# EAGLE design scHnRk_3 (EAGLE 7.5.0)
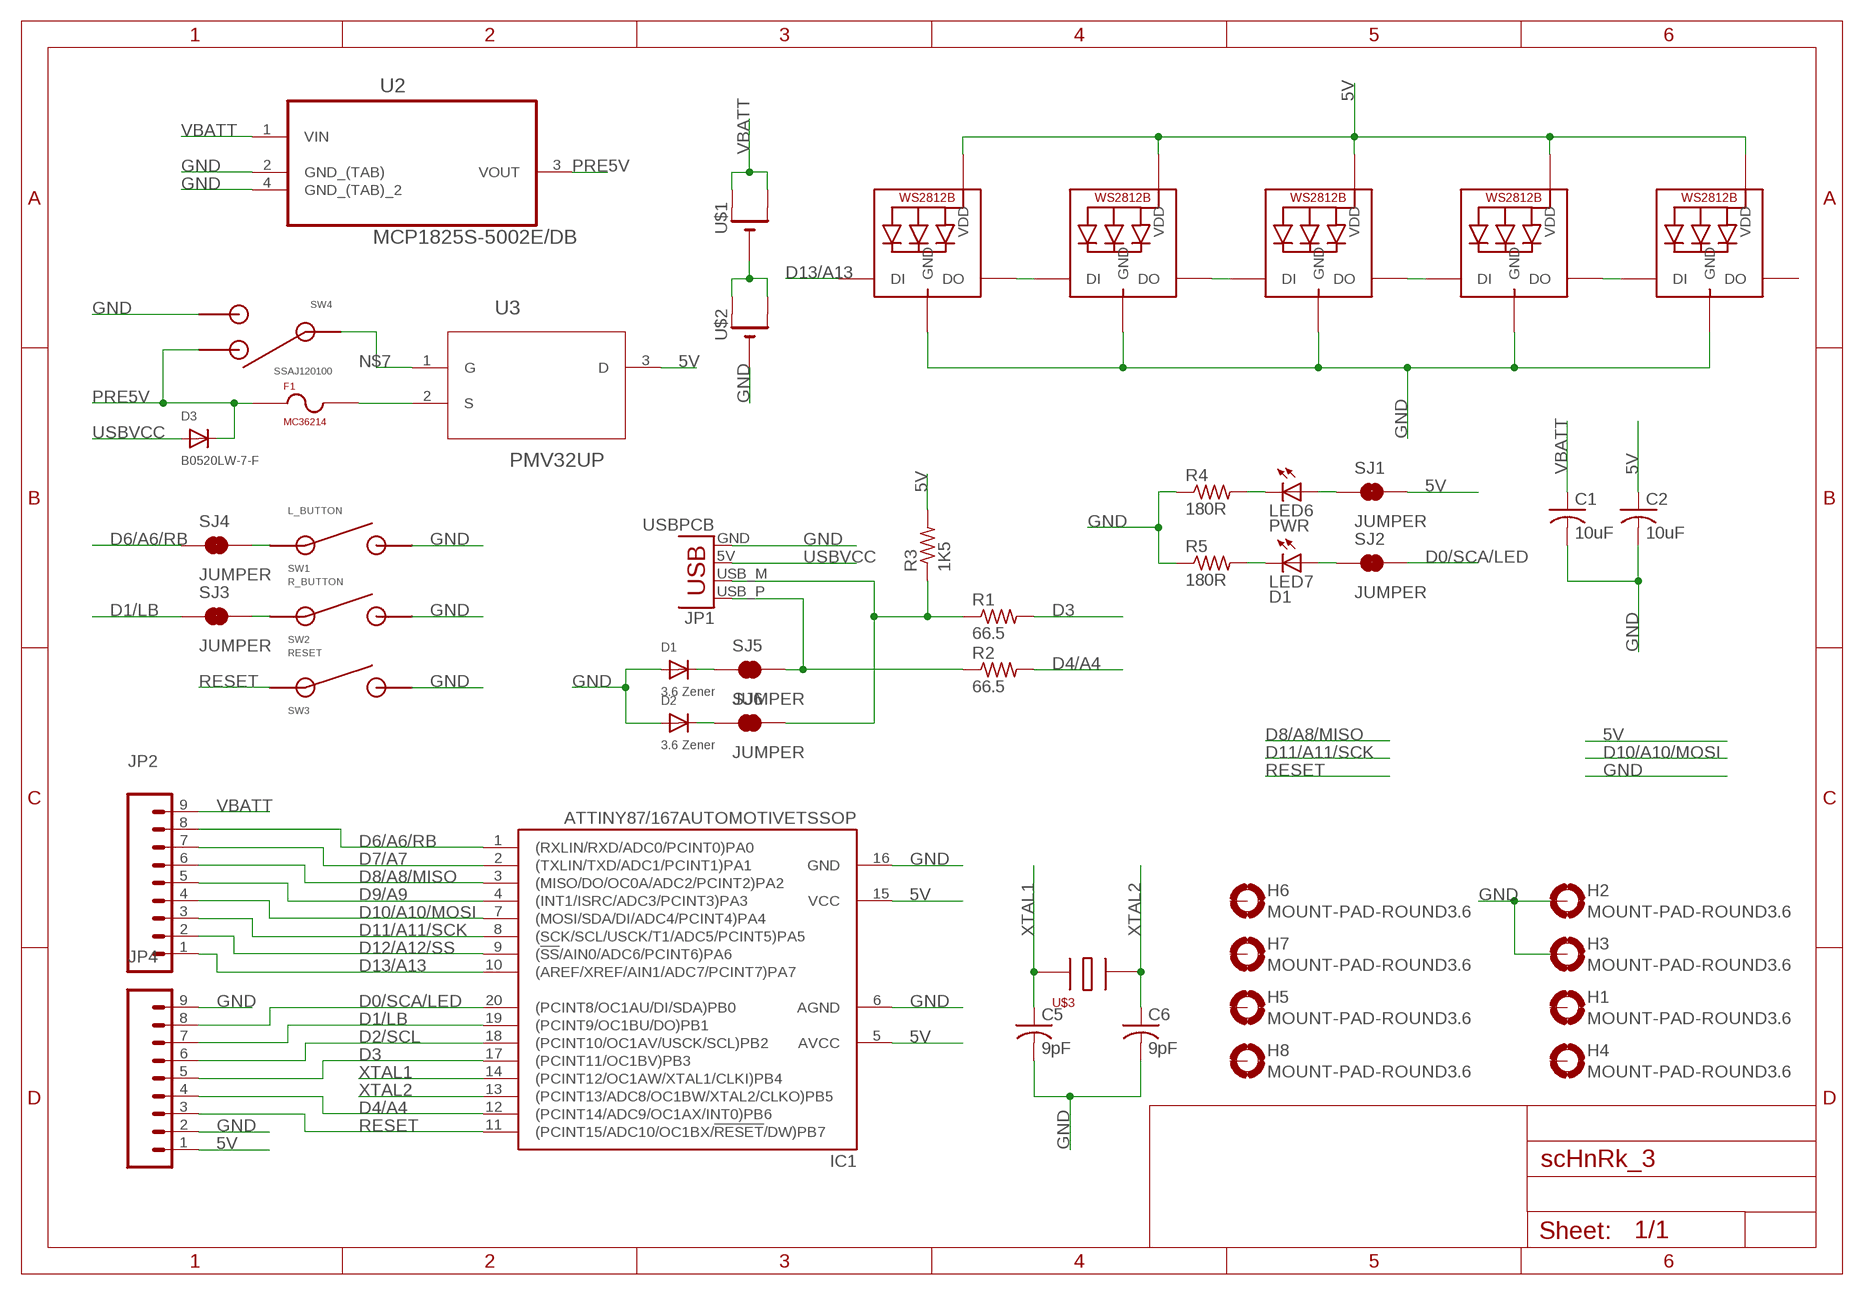
[diagram p0: schematic, sheet 1]

## Parts
C1  10uF  C-USC1206K  [C1206K]
C2  10uF  C-USC1206K  [C1206K]
C5  9pF  C-USC0603K  [C0603K]
C6  9pF  C-USC0603K  [C0603K]
D1  3.6 Zener  DIODESOD-523  [SOD-523]
D2  3.6 Zener  DIODESOD-523  [SOD-523]
D3  B0520LW-7-F  DIODESOD-123  [SOD-123]
F1  MC36214  [MC36214]
H1  MOUNT-PAD-ROUND3.6  [3,6-PAD]
H2  MOUNT-PAD-ROUND3.6  [3,6-PAD]
H3  MOUNT-PAD-ROUND3.6  [3,6-PAD]
H4  MOUNT-PAD-ROUND3.6  [3,6-PAD]
H5  MOUNT-PAD-ROUND3.6  [3,6-PAD]
H6  MOUNT-PAD-ROUND3.6  [3,6-PAD]
H7  MOUNT-PAD-ROUND3.6  [3,6-PAD]
H8  MOUNT-PAD-ROUND3.6  [3,6-PAD]
IC1  ATTINY87/167AUTOMOTIVETSSOP  [TSSOP20]
JP1  USBPCB  [USB-A-PCB]
JP2  M09  [1X09]
JP4  M09  [1X09]
LED1  WS2812B5050  [WS2812B]
LED2  WS2812B5050  [WS2812B]
LED3  WS2812B5050  [WS2812B]
LED4  WS2812B5050  [WS2812B]
LED5  WS2812B5050  [WS2812B]
LED6  PWR  LEDCHIPLED_0603  [CHIPLED_0603]
LED7  D1  LEDCHIPLED_0603  [CHIPLED_0603]
R1  66.5  R-US_R0603  [R0603]
R2  66.5  R-US_R0603  [R0603]
R3  1K5  R-US_R0603  [R0603]
R4  180R  R-US_R0603  [R0603]
R5  180R  R-US_R0603  [R0603]
SJ1  JUMPER  JUMPER-PAD-2-NC_BY_TRACE  [PAD-JUMPER-2-NC_BY_TRACE_YES_SILK]
SJ2  JUMPER  JUMPER-PAD-2-NC_BY_TRACE  [PAD-JUMPER-2-NC_BY_TRACE_YES_SILK]
SJ3  JUMPER  JUMPER-PAD-2-NC_BY_TRACE  [PAD-JUMPER-2-NC_BY_TRACE_YES_SILK]
SJ4  JUMPER  JUMPER-PAD-2-NC_BY_TRACE  [PAD-JUMPER-2-NC_BY_TRACE_YES_SILK]
SJ5  JUMPER  JUMPER-PAD-2-NC_BY_TRACE  [PAD-JUMPER-2-NC_BY_TRACE_YES_SILK]
SJ6  JUMPER  JUMPER-PAD-2-NC_BY_TRACE  [PAD-JUMPER-2-NC_BY_TRACE_YES_SILK]
SW1  L_BUTTON  SKRBAGE010  [SKRBAGE010]
SW2  R_BUTTON  SKRBAGE010  [SKRBAGE010]
SW3  RESET  SKRBAGE010  [SKRBAGE010]
SW4  SSAJ120100  [SSAJ120100]
U2  MCP1825S-5002E/DB  [SOT230P700X180-4N]
U3  PMV32UP  [SOT95P230X110-3N]
U$1  CR2032SMT  [CR2032-SMD]
U$2  CR2032SMT  [CR2032-SMD]
U$3  16MHZ-2467444  [16MHZ-2467444]

## Nets
5V: C2.1 IC1.5(AVCC) IC1.15(VCC) JP4.1 LED1.1-VDD(VDD) LED2.1-VDD(VDD) LED3.1-VDD(VDD) LED4.1-VDD(VDD) LED5.1-VDD(VDD) R3.2 SJ1.2 U3.3(D)
D0/SCA/LED: IC1.20((PCINT8/OC1AU/DI/SDA)PB0) JP4.8 SJ2.2
D1/LB: IC1.19((PCINT9/OC1BU/DO)PB1) JP4.7 SJ3.1
D2/SCL: IC1.18((PCINT10/OC1AV/USCK/SCL)PB2) JP4.6
D3: IC1.17((PCINT11/OC1BV)PB3) JP4.5 R1.2
D4/A4: IC1.12((PCINT14/ADC9/OC1AX/INT0)PB6) JP4.4 R2.2
D6/A6/RB: IC1.1((RXLIN/RXD/ADC0/PCINT0)PA0) JP2.8 SJ4.1
D7/A7: IC1.2((TXLIN/TXD/ADC1/PCINT1)PA1) JP2.7
D8/A8/MISO: IC1.3((MISO/DO/OC0A/ADC2/PCINT2)PA2) JP2.6
D9/A9: IC1.4((INT1/ISRC/ADC3/PCINT3)PA3) JP2.5
D10/A10/MOSI: IC1.7((MOSI/SDA/DI/ADC4/PCINT4)PA4) JP2.4
D11/A11/SCK: IC1.8((SCK/SCL/USCK/T1/ADC5/PCINT5)PA5) JP2.3
D12/A12/SS: IC1.9((!SS!/AIN0/ADC6/PCINT6)PA6) JP2.2
D13/A13: IC1.10((AREF/XREF/AIN1/ADC7/PCINT7)PA7) JP2.1 LED1.4-DIN(DI)
GND: C1.2 C2.2 C5.2 C6.2 D1.A D2.A H2.B3,6(MOUNT) H3.B3,6(MOUNT) IC1.6(AGND) IC1.16(GND) JP1.GND JP4.2 JP4.9 LED1.3-GND(GND) LED2.3-GND(GND) LED3.3-GND(GND) LED4.3-GND(GND) LED5.3-GND(GND) R4.1 R5.1 SW1.P$2 SW1.P$4 SW2.P$2 SW2.P$4 SW3.P$2 SW3.P$4 SW4.P$2 U2.2(GND_(TAB)) U2.4(GND_(TAB)_2) U$2.-
N$1: U$1.- U$2.+$1(+) U$2.+$2(+1)
N$2: SJ4.2 SW1.P$1 SW1.P$3
N$3: LED1.2-DOUT(DO) LED2.4-DIN(DI)
N$4: LED2.2-DOUT(DO) LED3.4-DIN(DI)
N$5: LED3.2-DOUT(DO) LED4.4-DIN(DI)
N$6: LED4.2-DOUT(DO) LED5.4-DIN(DI)
N$7: SW4.P$C U3.1(G)
N$8: SJ3.2 SW2.P$1 SW2.P$3
N$9: D1.K(C) SJ5.1
N$10: D2.K(C) SJ6.1
N$15: JP1.USB_M(D-) R1.1 R3.1 SJ6.2
N$16: JP1.USB_P(D+) R2.1 SJ5.2
N$22: F1.P$2 U3.2(S)
N$28: LED6.C R4.2
N$29: LED7.C R5.2
N$31: LED6.A SJ1.1
N$34: LED7.A SJ2.1
PRE5V: D3.C F1.P$1 SW4.P$1 U2.3(VOUT)
RESET: IC1.11((PCINT15/ADC10/OC1BX/!RESET!/DW)PB7) JP4.3 SW3.P$1 SW3.P$3
USBVCC: D3.A JP1.5V(VBUS)
VBATT: C1.1 JP2.9 U2.1(VIN) U$1.+$1(+) U$1.+$2(+1)
XTAL1: C5.1 IC1.14((PCINT12/OC1AW/XTAL1/CLKI)PB4) U$3.P$1
XTAL2: C6.1 IC1.13((PCINT13/ADC8/OC1BW/XTAL2/CLKO)PB5) U$3.P$3
Unconnected: H1.B3,6(MOUNT) H4.B3,6(MOUNT) H5.B3,6(MOUNT) H6.B3,6(MOUNT) H7.B3,6(MOUNT) H8.B3,6(MOUNT) LED5.2-DOUT(DO)

## Library data of the parts
C1 C2 C5 C6 = adafruit:C-US: CAPACITOR, American symbol
D1-D3 = adafruit:DIODE: Diode SMADIODE - SMA Surface Mount Package 20V 1A Schottky Diode Digikey: 641-1014-6-ND DO-1N4148 - Through Hole Small Current Diode SOD-123 20V 1 A (.5mV Vf) Schottky Diode - Digikey: MBRX120TPMSCT-ND SOD-323 10V 570mA (.38mV Vf, 3ns) Schottky Diode - Digikey: ZLLS410CT-ND SOD-523 30V 30mA Schottky Diode (RB751S-40TE61) - Digikey: RB751S-40TE61CT-ND SOT23-R/W - SOT23 Package (R = Solder Paste/Reflow Ovens, W = Hand-Soldering) BAT54Film 40V 300mA - Digikey: 497-7162-1-ND
F1 = scHnRk:MC36214
H1-H8 = holes:MOUNT-PAD-ROUND: MOUNTING PAD, round
IC1 = attiny87_167_automotive:ATTINY87/167AUTOMOTIVE
JP1 = SparkFun-Connectors:USB: USB Connectors USB-B-PTH is fully proven SKU : PRT-00139/CONN-08278 USB-miniB is fully proven SKU : PRT-00587 USB-A-PCB is untested. USB-A-H is throughly reviewed, but untested. Spark Fun Electronics SKU : PRT-00437 USB-B-SMT is throughly reviewed, but untested. Needs silkscreen touching up. USB-A-S has not been used/tested USB-MB-H has not been used/tested USB-MICROB has been used. CONN-09505
JP2 JP4 = SparkFun-Connectors:M09: Header 9 Standard 9-pin 0.1" header. Use with straight break away headers (SKU : PRT-00116), right angle break away headers (PRT-00553), swiss pins (PRT-00743), machine pins (PRT-00117), and female headers (PRT-00115).
LED1-LED5 = adafruit:WS2812B
LED6 LED7 = adafruit:LED: LED OSRAM: - CHIPLED LG R971, LG N971, LY N971, LG Q971, LY Q971, LO R971, LY R971 LH N974, LH R974 LS Q976, LO Q976, LY Q976 LO Q996 - Hyper CHIPLED LW Q18S LB Q993, LB Q99A, LB R99A - SideLED LS A670, LO A670, LY A670, LG A670, LP A670 LB A673, LV A673, LT A673, LW A673 LH A674 LY A675 LS A676, LA A676, LO A676, LY A676, LW A676 LS A679, LY A679, LG A679 - Hyper Micro SIDELED® LS Y876, LA Y876, LO Y876, LY Y876 LT Y87S - SmartLED LW L88C, LW L88S LB L89C, LB L89S, LG L890 LS L89K, LO L89K, LY L89K LS L896, LA L896, LO L896, LY L896 - TOPLED LS T670, LO T670, LY T670, LG T670, LP T670 LSG T670, LSP T670, LSY T670, LOP T670, LYG T670 LG T671, LOG T671, LSG T671 LB T673, LV T673, LT T673, LW T673 LH T674 LS T676, LA T676, LO T676, LY T676, LB T676, LH T676, LSB T676, LW T676 LB T67C, LV T67C, LT T67C, LS T67K, LO T67K, LY T67K, LW E67C LS E67B, LA E67B, LO E67B, LY E67B, LB E67C, LV E67C, LT E67C LW T67C LS T679, LY T679, LG T679 LS T770, LO T770, LY T770, LG T770, LP T770 LB T773, LV T773, LT T773, LW T773 LH T774 LS E675, LA E675, LY E675, LS T675 LS T776, LA T776, LO T776, LY T776, LB T776 LHGB T686 LT T68C, LB T68C - Hyper Mini TOPLED® LB M676 - Mini TOPLED Santana® LG M470 LS M47K, LO M47K, LY M47K Source: http://www.osram.convergy.de/
R1-R5 = adafruit:R-US_: RESISTOR, American symbol
SJ1-SJ6 = SparkFun-Passives:JUMPER-PAD-2-NC_BY_TRACE
SW1-SW3 = scHnRk:SKRBAGE010
SW4 = scHnRk:SSAJ120100
U2 = Microchip_By_element14_Batch_1:MCP1825S-5002E/DB: IC, LDO, 5.0V, 500MA; MPN: MCP1825S-5002E/DB; OC_FARNELL: 1578407; OC_NEWARK: 26M9964; PACKAGE: SOT-223-3; SUPPLIER: Microchip
U3 = NXP_By_element14_Batch_1:PMV32UP: P-channel Trench MOSFET; MPN: PMV32UP; OC_FARNELL: 1894624; OC_NEWARK: 47T2356; PACKAGE: SOT-3; SUPPLIER: NXP Semiconductors
U$1 U$2 = adafruit:CR2032
U$3 = scHnRk:16MHZ-2467444

## Net classes
0 default: clearance 0.508 mm

## Board
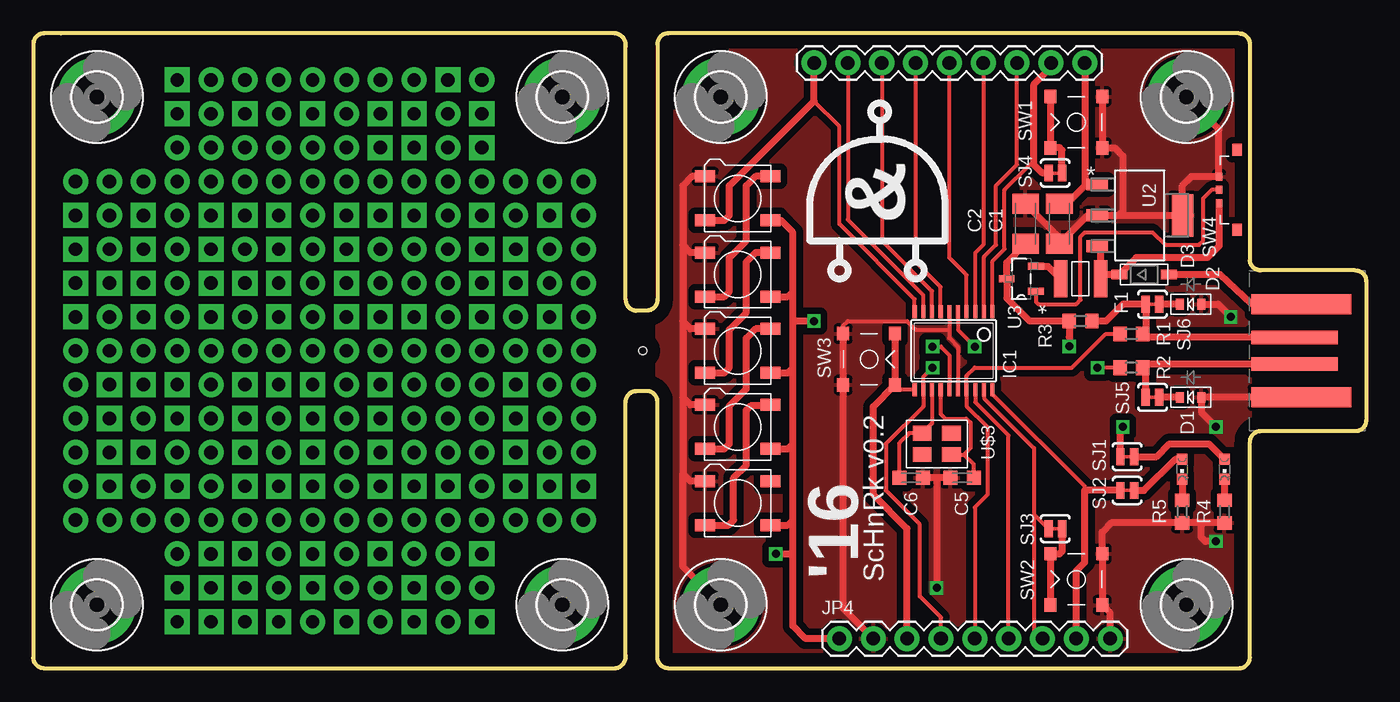
[diagram p1: board, top side]
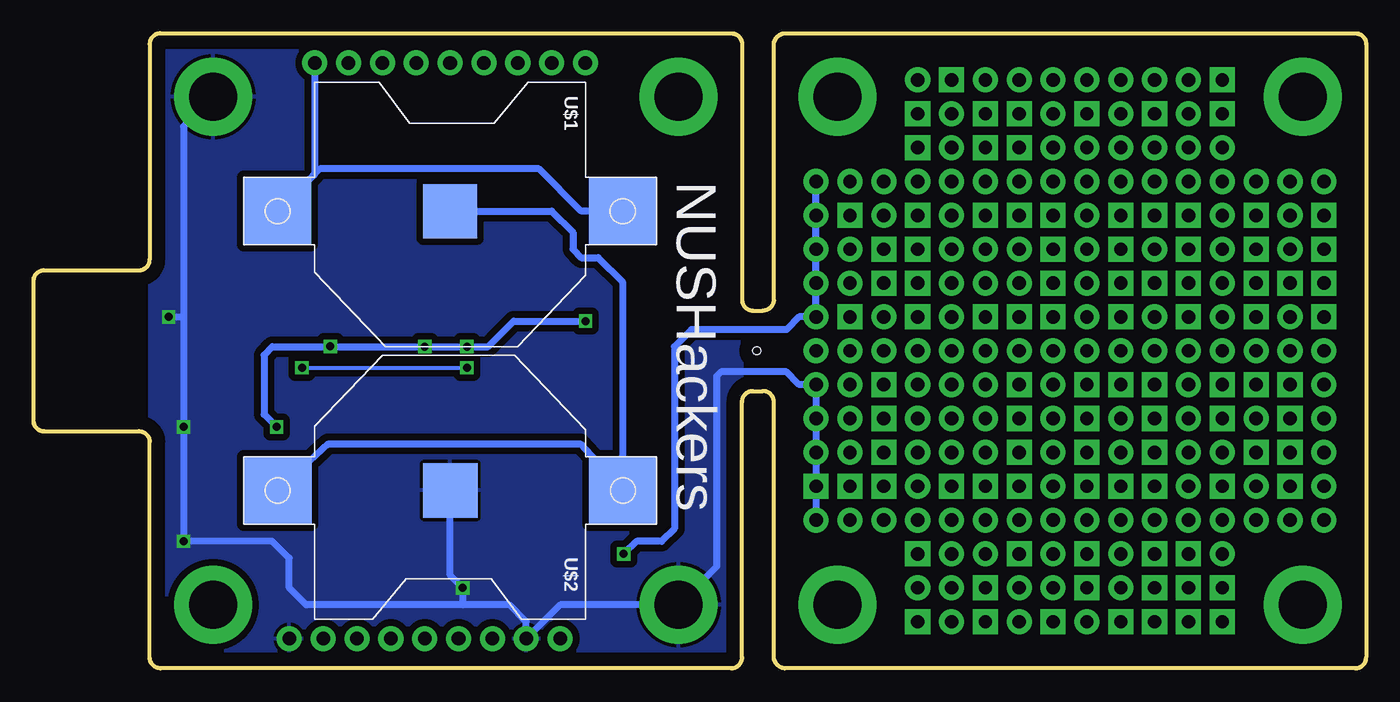
[diagram p2: board, bottom side, seen from below]

Size 100.01 x 47.62 mm. Coordinates in mm from the lower left corner, seen from the top.
Outline: 2.08,47.63 43.64,47.63 arc-90 44.45,46.65 44.45,27.64 arc90 45.26,26.83 46.02,26.83 arc90 46.83,27.64 46.83,46.81 arc-90 47.64,47.63 90.47,47.63 arc-90 91.28,46.81 91.28,30.66 arc90 92.09,29.84 99.2,29.84 arc-90 100.01,29.03 100.01,18.59 arc-90 99.2,17.78 92.09,17.78 arc90 91.28,16.97 91.28,0.81 arc-90 90.47,0 47.64,0 arc-90 46.83,0.81 46.83,19.98 arc90 46.02,20.8 45.26,20.8
Outline: 45.26,20.8 45.24,20.8
Outline: 45.26,20.8 arc90 44.45,19.98 44.45,0.97 arc-90 43.64,0 0.81,0 arc-90 0,0.81 0,46.81 arc-90 0.81,47.63 2.06,47.63
Copper layers (1*16): Top 0.035mm / dielectric 1.5mm / Bottom 0.035mm
Design rules "default *": minimum track width 10mil, minimum drill 24mil, track to track 10mil, track to pad 10mil, pad to pad 10mil, via to via 10mil, smd to smd 10mil, copper to edge 40mil, drill to drill 12mil, minimum pad ring 10mil, minimum via ring 8mil, stop-mask expansion 4mil, vias tented up to drill 0mil, thermal gap 10mil
Holes 0.6 mm at 45.72,23.81

### Footprints (pad centres in the part's own frame; a part is rotated, then mirrored left to right if it is on the bottom)
C1206K = smd 1.5 x 2: 1 -1.5,0; 2 1.5,0
C0603K = smd 1.05 x 1.08: 1 -0.875,0; 2 0.875,0
SOD-523 = smd 0.8 x 0.6: A 0,-0.8; K 0,0.8
SOD-123 = smd 1.2 x 0.7: A 1.85,0; C -1.85,0
MC36214 = smd 1 x 2.8: P$1 -1.5,0; P$2 1.5,0
3,6-PAD = drill 3.6 pad 5.842: B3,6 0,0
TSSOP20 = smd 0.305 x 0.991: 1 -2.925,-2.918; 2 -2.275,-2.918; 3 -1.625,-2.918; 4 -0.975,-2.918; 5 -0.325,-2.918; 6 0.325,-2.918; 7 0.975,-2.918; 8 1.625,-2.918; 9 2.275,-2.918; 10 2.925,-2.918; 11 2.925,2.918; 12 2.275,2.918; 13 1.625,2.918; 14 0.975,2.918; 15 0.325,2.918; 16 -0.325,2.918; 17 -0.975,2.918; 18 -1.625,2.918; 19 -2.275,2.918; 20 -2.925,2.918
USB-A-PCB = smd 7.5 x 1.5: 5V -0.2,-3.5; GND -0.2,3.5 | smd 6.5 x 1: USB_M 0.3,-1; USB_P 0.3,1
1X09 = drill 1.016 pad 1.88: 1 0,0; 2 2.54,0; 3 5.08,0; 4 7.62,0; 5 10.16,0; 6 12.7,0; 7 15.24,0; 8 17.78,0; 9 20.32,0
WS2812B = smd 1.5 x 0.9: 1-VDD 2.45,-1.65; 2-DOUT 2.45,1.65; 3-GND -2.45,1.65; 4-DIN -2.45,-1.65
CHIPLED_0603 = smd 0.8 x 0.8: A 0,-0.75; C 0,0.75
R0603 = smd 1 x 1.1: 1 -0.85,0; 2 0.85,0
PAD-JUMPER-2-NC_BY_TRACE_YES_SILK = smd 0.635 x 1.27: 1 -0.508,0; 2 0.508,0
SKRBAGE010 = smd 1 x 0.9: P$1 -1.925,1.95; P$2 -1.925,-1.95; P$3 1.925,1.95; P$4 1.925,-1.95
SSAJ120100 = smd 0.6 x 0.51: P$1 -1,1.36; P$2 1,1.36; P$C 0,1.36 | smd 0.9 x 0.7: P$3 -3,0; P$4 3,0
SOT230P700X180-4N = smd 1.626 x 0.889: 1 -3.2,2.311; 2 -3.2,0; 3 -3.2,-2.311 | smd 1.626 x 3.175: 4 3.2,0
SOT95P230X110-3N = smd 1.168 x 0.533: 1 -1.092,0.94; 2 -1.092,-0.94; 3 1.092,0
CR2032-SMD = smd 5.08 x 5.08: +$1 -12.954,0; +$2 12.954,0 | smd 4.064 x 4.064: - 0,0
16MHZ-2467444 = smd 1.4 x 1.1: P$1 -1.1,0.8; P$2 1.1,0.8; P$3 1.1,-0.8; P$4 -1.1,-0.8

### Placement (x,y rotation side)
C1  76.99,33.34 270 top
C2  74.45,33.34 90 top
C5  69.69,14.29 180 top
C6  65.88,14.29 0 top
D1  86.84,20.32 90 top
D2  86.84,27.3 90 top
D3  83.34,29.53 0 top
F1  78.58,29.21 180 top
H1  51.59,42.86 0 top
H2  51.59,4.76 0 top
H3  86.52,42.86 0 top
H4  86.52,4.76 0 top
H5  39.69,42.86 0 top
H6  39.69,4.76 0 top
H7  4.76,4.76 0 top
H8  4.76,42.86 0 top
IC1  69.06,23.81 180 top
JP1  94.93,23.81 180 top
JP2  58.58,45.4 0 top
JP4  60.48,2.22 0 top
LED1  52.86,35.24 0 top
LED2  52.86,29.53 0 top
LED3  52.86,23.81 0 top
LED4  52.86,18.1 0 top
LED5  52.86,12.38 0 top
LED6  89.38,14.92 180 top
LED7  86.2,14.92 180 top
R1  82.39,25.08 180 top
R2  82.39,22.54 180 top
R3  78.58,26.04 180 top
R4  89.38,11.75 90 top
R5  86.2,11.75 90 top
SJ1  82.07,15.88 180 top
SJ2  82.07,13.33 180 top
SJ3  76.68,10.48 0 top
SJ4  76.68,37.15 0 top
SJ5  83.98,20.32 180 top
SJ6  83.98,27.3 180 top
SW1  78.26,40.96 90 top
SW2  78.26,6.67 90 top
SW3  62.71,23.18 270 top
SW4  90.33,35.88 90 top
U2  83.03,33.97 0 top
U3  74.14,29.21 180 top
U$1  68.74,34.29 0 bottom
U$2  68.73,13.33 180 bottom
U$3  67.79,16.83 180 top

### Tracks (layer width: path | path; a pad name or v marks a point on that pad's centre or on a via)
5V  (via drill 0.6, 1 pad 1.88)
  Top 0.305: IC1.5 69.38,25.39 v70.64,24.13 | v67.47,24.13 68.1,24.13 68.74,23.5 IC1.15
  Top 0.508: LED5.1-VDD 56.61,10.73 56.99,11.11 | LED1.1-VDD 56.1,33.59 56.99,32.7 56.99,28.26 | 56.99,11.11 56.99,16.83 | 56.99,16.83 56.99,22.54 | 56.99,22.54 56.99,25.88 | 56.99,25.88 56.99,28.26 | LED4.1-VDD 56.61,16.45 56.99,16.83 | LED3.1-VDD 56.61,22.16 56.99,22.54 | LED2.1-VDD 56.61,27.88 56.99,28.26 | JP4.1 57.94,2.22 56.99,3.18 56.99,8.57 | 56.99,8.57 56.99,11.11 | C2.1 73.04,30.43 U3.3 73.04,27.76 74.77,26.04 R3.2 77.73,24.83 v77.73,24.14 | SJ1.2 81.57,17.91 v81.76,18.1 | v58.58,26.04 57.15,26.04 56.99,25.88 | v55.72,8.57 56.99,8.57
  Bottom 0.508: 77.81,24.13 82.07,24.13 82.71,23.5 82.71,19.05 v81.76,18.1 | 77.81,24.13 v70.64,24.13 v67.47,24.13 65.88,24.13 63.98,26.04 v58.58,26.04 | v77.73,24.14 77.73,24.21 77.81,24.13 | v55.72,8.57 54.77,9.52 52.86,9.52 51.91,10.48 51.91,24.13 50.64,25.4 43.5,25.4 42.55,26.35 v41.28,26.35 v41.28,28.89 v41.28,31.43 v41.28,33.97 v41.28,36.51
D0/SCA/LED
  Top 0.305: 78.9,13.33 78.9,13.65 71.98,20.57 IC1.20
  Top 0.508: JP4.8 78.26,7.3 78.9,7.94 78.9,13.33 SJ2.2
D1/LB
  Top 0.305: IC1.19 71.33,20.27 75.09,16.51 75.09,11.56 | 75.09,11.56 75.09,2.86 JP4.7 | 75.09,11.56 SJ3.1
D2/SCL
  Top 0.305: IC1.18 70.68,19.97 73.18,17.46 JP4.6
D3
  Top 0.305: JP4.5 70.64,12.07 71.6,13.02 71.6,18.1 70.03,19.66 IC1.17 70.03,21.93 70.64,22.54 77.95,22.54 80.49,25.08 R1.2
D4/A4  (via drill 0.6)
  Top 0.305: R2.2 v79.85,22.54 | v67.47,22.54 66.78,21.86 IC1.12 66.78,19.63 63.98,16.83 63.98,13.33 66.52,10.8 66.52,5.4 68.1,3.81 JP4.4
  Bottom 0.305: v79.85,22.54 v67.47,22.54
D6/A6/RB
  Top 0.305: IC1.1 71.98,30.55 72.87,31.43 72.87,35.88 74.77,37.78 75.09,37.78
  Top 0.508: JP2.8 76.36,45.09 75.09,43.81 75.09,37.78 75.72,37.15 SJ4.1
D7/A7
  Top 0.305: IC1.2 71.33,30.85 72.23,31.75 72.23,36.2 73.82,37.78 JP2.7
D8/A8/MISO
  Top 0.305: IC1.3 70.68,31.15 71.28,31.75 JP2.6
D9/A9
  Top 0.305: IC1.4 70.03,29.5 68.74,30.8 JP2.5
D10/A10/MOSI
  Top 0.305: JP2.4 66.2,30.48 68.08,28.6 IC1.7
D11/A11/SCK
  Top 0.305: JP2.3 63.66,32.07 67.43,28.29 IC1.8
D12/A12/SS
  Top 0.305: JP2.2 61.12,33.66 66.78,27.99 IC1.9
D13/A13
  Top 0.305: IC1.10 66.13,27.69 60.48,33.34 60.48,40.64 58.58,42.55
  Top 0.508: LED1.4-DIN 51.85,33.59 52.23,33.97 52.23,36.2 58.58,42.55 JP2.1
GND  (via drill 0.6, 1 pad 1.88)
  Top 0.305: IC1.6 68.73,25.4 | 68.73,25.4 68.73,24.77 69.37,24.13 IC1.16 | SW3.P$2 60.76,25.67 61.12,26.04 65.56,26.04 66.2,25.4 68.73,25.4
  Top 0.508: LED1.3-GND 49.43,36.89 48.74,36.2 48.74,31.75 | 48.74,31.75 48.74,26.04 | 48.74,26.04 48.74,20.32 | 48.74,20.32 48.74,14.6 | LED4.3-GND 49.31,19.75 48.74,20.32 | LED5.3-GND 49.31,14.03 48.74,14.6 | LED3.3-GND 49.31,25.46 48.74,26.04 | LED2.3-GND 49.31,31.18 48.74,31.75 | R4.1 87.79,10.9 | 87.79,10.9 R5.1 80.91,10.9 80.21,10.21 SW2.P$4 SW2.P$2 80.8,4.15 JP4.9 | SW1.P$4 SW1.P$2 81.14,39.03 81.76,38.42 81.76,34.29 81.44,33.97 U2.2 | U2.2 U2.4 86.23,36.22 86.88,36.88 SW4.P$2 88.97,40.41 H3.B3,6 | U2.2 79.13,33.97 C1.2 76.99,32.3 C2.2 | JP1.GND D1.A | D1.A | 67.79,14.29 C6.2 | D1.A 87.64,19.2 v88.74,18.1 | 67.79,14.29 v67.79,6.03 | C5.2 67.79,14.29 | JP4.2 60.76,4.49 SW3.P$4 SW3.P$2 | H2.B3,6 48.74,7.62 48.74,14.6 | D2.A 88.9,27.31 v89.85,26.35 | v88.74,9.52 87.95,9.52 87.63,9.84 87.63,10.74 87.79,10.9
  Bottom 0.508: 67.79,4.76 64.29,4.76 63.02,3.49 JP4.2 60.48,4.76 H2.B3,6 48.74,7.62 48.74,21.91 48.42,22.22 43.5,22.22 42.55,21.27 v41.28,21.27 v41.28,18.73 v41.28,16.19 v41.28,13.65 v41.28,11.11 | 67.79,4.76 79.53,4.76 80.8,6.03 80.8,8.25 82.07,9.52 v88.74,9.52 v88.74,18.1 88.74,26.35 | 67.79,4.76 v67.79,6.03 68.73,6.97 U$2.- | 88.74,26.35 88.74,40.64 H3.B3,6 | v89.85,26.35 88.74,26.35
  pour Top: 75.72,47.62 90.47,47.62 arc-90 91.28,46.81 91.28,35.08 91.28,0.81 arc-90 90.47,0 70.33,0 47.64,0 arc-90 46.83,0.81 46.83,35.72 46.83,46.81 arc-90 47.64,47.62
  pour Bottom: 63.98,47.62 90.47,47.62 arc-90 91.28,46.81 91.28,44.45 91.28,0.81 arc-90 90.47,0 81.28,0 47.64,0 arc-90 46.83,0.81 46.83,40.96 46.83,46.81 arc-90 47.64,47.62
N$1
  Bottom 0.508: U$1.- 61.12,34.29 59.53,32.7 59.53,31.43 58.9,30.8 57.63,30.8 55.77,28.94 U$2.+$1 58.96,16.83 77.88,16.83 U$2.+$2
N$2
  Top 0.508: SJ4.2 77.18,38.86 76.99,39.05 76.33,39.05 SW1.P$1 SW1.P$3
N$3
  Top 0.508: LED2.4-DIN 51.85,27.88 52.23,28.26 52.23,30.8 53.5,32.07 53.5,36.2 54.2,36.89 LED1.2-DOUT
N$4
  Top 0.508: LED3.4-DIN 51.85,22.16 52.23,22.54 52.23,25.4 53.5,26.67 53.5,30.48 54.2,31.18 LED2.2-DOUT
N$5
  Top 0.508: LED4.4-DIN 51.85,16.45 52.23,16.83 52.23,19.68 53.5,20.95 53.5,24.77 54.2,25.46 LED3.2-DOUT
N$6
  Top 0.508: LED4.2-DOUT 55.25,19.68 53.82,19.68 53.5,19.37 53.5,15.24 52.55,14.29 52.55,11.11 52.17,10.73 LED5.4-DIN
N$7
  Top 0.305: U3.1 75.23,27.48 75.41,27.31 78.26,27.31 78.58,27.62 78.58,32.38 78.9,32.7 83.98,32.7 84.93,31.75 87.47,31.75 87.79,32.07 87.79,35.24 88.42,35.88 SW4.P$C
N$8
  Top 0.508: SW2.P$1 SW2.P$3 76.33,8.57 76.99,8.57 77.18,8.76 SJ3.2
N$9
  Top 0.508: D1.K SJ5.1
N$10
  Top 0.508: D2.K SJ6.1
N$12  (via drill 1 pad 1.88)
  other vias: 41.28,23.81
N$13  (via drill 1 pad 1.88)
  other vias: 38.73,26.35
N$15
  Top 0.508: JP1.USB_M 83.51,24.81 R1.1 83.47,25.31 SJ6.2 81.76,27.31 80.49,26.04 R3.1
N$16
  Top 0.508: JP1.USB_P 83.51,22.81 R2.1 83.47,22.31 SJ5.2
N$17  (via drill 1 pad 1.88)
  other vias: 38.73,28.89
N$18  (via drill 1 pad 1.88)
  other vias: 38.73,31.43
N$19  (via drill 1 pad 1.88)
  other vias: 38.73,33.97
N$22
  Top 0.508: U3.2 76.14,30.15 F1.P$2
N$28
  Top 0.508: LED6.C R4.2
N$29
  Top 0.508: LED7.C R5.2
N$30  (via drill 1 pad 1.88)
  other vias: 38.73,36.51
N$31
  Top 0.508: SJ1.1 84.3,15.88 85.25,16.83 88.22,16.83 LED6.A
N$32  (via drill 1 pad 1.88)
  other vias: 36.2,33.97
N$33  (via drill 1 pad 1.88)
  other vias: 36.2,31.43
N$34
  Top 0.508: SJ2.1 83.34,13.33 85.68,15.67 LED7.A
N$35  (via drill 1 pad 1.88)
  other vias: 36.2,28.89
N$36  (via drill 1 pad 1.88)
  other vias: 36.2,26.35
N$37  (via drill 1 pad 1.88)
  other vias: 38.73,23.81
N$38  (via drill 1 pad 1.88)
  other vias: 38.73,21.27
N$39  (via drill 1 pad 1.88)
  other vias: 38.73,18.73
N$42  (via drill 1 pad 1.88)
  other vias: 38.73,16.19
N$44  (via drill 1 pad 1.88)
  other vias: 38.73,13.65
N$45  (via drill 1 pad 1.88)
  other vias: 38.73,11.11
N$53  (via drill 1 pad 1.88)
  other vias: 36.2,21.27
N$54  (via drill 1 pad 1.88)
  other vias: 36.2,23.81
N$55  (via drill 1 pad 1.88)
  other vias: 33.66,26.35
N$56  (via drill 1 pad 1.88)
  other vias: 33.66,28.89
N$57  (via drill 1 pad 1.88)
  other vias: 33.66,31.43
N$58  (via drill 1 pad 1.88)
  other vias: 33.66,33.97
N$59  (via drill 1 pad 1.88)
  other vias: 36.2,36.51
N$63  (via drill 1 pad 1.88)
  other vias: 33.66,44.13
N$64  (via drill 1 pad 1.88)
  other vias: 33.66,41.59
N$65  (via drill 1 pad 1.88)
  other vias: 33.66,39.05
N$66  (via drill 1 pad 1.88)
  other vias: 33.66,36.51
N$67  (via drill 1 pad 1.88)
  other vias: 31.11,33.97
N$68  (via drill 1 pad 1.88)
  other vias: 31.11,31.43
N$69  (via drill 1 pad 1.88)
  other vias: 31.11,28.89
N$70  (via drill 1 pad 1.88)
  other vias: 31.11,26.35
N$71  (via drill 1 pad 1.88)
  other vias: 33.66,23.81
N$72  (via drill 1 pad 1.88)
  other vias: 33.66,21.27
N$73  (via drill 1 pad 1.88)
  other vias: 33.66,18.73
N$74  (via drill 1 pad 1.88)
  other vias: 36.2,18.73
N$75  (via drill 1 pad 1.88)
  other vias: 36.2,16.19
N$76  (via drill 1 pad 1.88)
  other vias: 33.66,16.19
N$77  (via drill 1 pad 1.88)
  other vias: 36.2,13.65
N$78  (via drill 1 pad 1.88)
  other vias: 33.66,13.65
N$79  (via drill 1 pad 1.88)
  other vias: 33.66,11.11
N$80  (via drill 1 pad 1.88)
  other vias: 36.2,11.11
N$82  (via drill 1 pad 1.88)
  other vias: 33.66,8.57
N$83  (via drill 1 pad 1.88)
  other vias: 33.66,6.03
N$86  (via drill 1 pad 1.88)
  other vias: 33.66,3.49
N$87  (via drill 1 pad 1.88)
  other vias: 31.11,21.27
N$88  (via drill 1 pad 1.88)
  other vias: 31.11,23.81
N$89  (via drill 1 pad 1.88)
  other vias: 28.57,26.35
N$90  (via drill 1 pad 1.88)
  other vias: 28.57,28.89
N$91  (via drill 1 pad 1.88)
  other vias: 28.57,31.43
N$92  (via drill 1 pad 1.88)
  other vias: 28.57,33.97
N$93  (via drill 1 pad 1.88)
  other vias: 31.11,36.51
N$94  (via drill 1 pad 1.88)
  other vias: 31.11,39.05
N$95  (via drill 1 pad 1.88)
  other vias: 31.11,41.59
N$96  (via drill 1 pad 1.88)
  other vias: 31.11,44.13
N$97  (via drill 1 pad 1.88)
  other vias: 28.57,44.13
N$98  (via drill 1 pad 1.88)
  other vias: 28.57,41.59
N$99  (via drill 1 pad 1.88)
  other vias: 28.57,39.05
N$100  (via drill 1 pad 1.88)
  other vias: 28.57,36.51
N$101  (via drill 1 pad 1.88)
  other vias: 26.04,33.97
N$102  (via drill 1 pad 1.88)
  other vias: 26.04,31.43
N$103  (via drill 1 pad 1.88)
  other vias: 26.04,28.89
N$104  (via drill 1 pad 1.88)
  other vias: 26.04,26.35
N$105  (via drill 1 pad 1.88)
  other vias: 28.57,23.81
N$106  (via drill 1 pad 1.88)
  other vias: 28.57,21.27
N$107  (via drill 1 pad 1.88)
  other vias: 28.57,18.73
N$108  (via drill 1 pad 1.88)
  other vias: 31.11,18.73
N$109  (via drill 1 pad 1.88)
  other vias: 31.11,16.19
N$110  (via drill 1 pad 1.88)
  other vias: 28.57,16.19
N$111  (via drill 1 pad 1.88)
  other vias: 31.11,13.65
N$112  (via drill 1 pad 1.88)
  other vias: 28.57,13.65
N$113  (via drill 1 pad 1.88)
  other vias: 28.57,11.11
N$114  (via drill 1 pad 1.88)
  other vias: 31.11,11.11
N$115  (via drill 1 pad 1.88)
  other vias: 31.11,8.57
N$116  (via drill 1 pad 1.88)
  other vias: 28.57,8.57
N$117  (via drill 1 pad 1.88)
  other vias: 28.57,6.03
N$118  (via drill 1 pad 1.88)
  other vias: 31.11,6.03
N$119  (via drill 1 pad 1.88)
  other vias: 31.11,3.49
N$120  (via drill 1 pad 1.88)
  other vias: 28.57,3.49
N$121  (via drill 1 pad 1.88)
  other vias: 26.04,21.27
N$122  (via drill 1 pad 1.88)
  other vias: 26.04,23.81
N$123  (via drill 1 pad 1.88)
  other vias: 23.49,26.35
N$124  (via drill 1 pad 1.88)
  other vias: 23.49,28.89
N$125  (via drill 1 pad 1.88)
  other vias: 23.49,31.43
N$126  (via drill 1 pad 1.88)
  other vias: 23.49,33.97
N$127  (via drill 1 pad 1.88)
  other vias: 26.04,36.51
N$128  (via drill 1 pad 1.88)
  other vias: 26.04,39.05
N$129  (via drill 1 pad 1.88)
  other vias: 26.04,41.59
N$130  (via drill 1 pad 1.88)
  other vias: 26.04,44.13
N$131  (via drill 1 pad 1.88)
  other vias: 23.49,44.13
N$132  (via drill 1 pad 1.88)
  other vias: 23.49,41.59
N$133  (via drill 1 pad 1.88)
  other vias: 23.49,39.05
N$134  (via drill 1 pad 1.88)
  other vias: 23.49,36.51
N$135  (via drill 1 pad 1.88)
  other vias: 20.95,33.97
N$136  (via drill 1 pad 1.88)
  other vias: 20.95,31.43
N$137  (via drill 1 pad 1.88)
  other vias: 20.95,28.89
N$138  (via drill 1 pad 1.88)
  other vias: 20.95,26.35
N$139  (via drill 1 pad 1.88)
  other vias: 23.49,23.81
N$140  (via drill 1 pad 1.88)
  other vias: 23.49,21.27
N$141  (via drill 1 pad 1.88)
  other vias: 23.49,18.73
N$142  (via drill 1 pad 1.88)
  other vias: 26.04,18.73
N$143  (via drill 1 pad 1.88)
  other vias: 26.04,16.19
N$144  (via drill 1 pad 1.88)
  other vias: 23.49,16.19
N$145  (via drill 1 pad 1.88)
  other vias: 26.04,13.65
N$146  (via drill 1 pad 1.88)
  other vias: 23.49,13.65
N$147  (via drill 1 pad 1.88)
  other vias: 23.49,11.11
N$148  (via drill 1 pad 1.88)
  other vias: 26.04,11.11
N$149  (via drill 1 pad 1.88)
  other vias: 26.04,8.57
N$150  (via drill 1 pad 1.88)
  other vias: 23.49,8.57
N$151  (via drill 1 pad 1.88)
  other vias: 23.49,6.03
N$152  (via drill 1 pad 1.88)
  other vias: 26.04,6.03
N$153  (via drill 1 pad 1.88)
  other vias: 26.04,3.49
N$154  (via drill 1 pad 1.88)
  other vias: 23.49,3.49
N$155  (via drill 1 pad 1.88)
  other vias: 20.95,21.27
N$156  (via drill 1 pad 1.88)
  other vias: 20.95,23.81
N$157  (via drill 1 pad 1.88)
  other vias: 18.41,26.35
N$158  (via drill 1 pad 1.88)
  other vias: 18.41,28.89
N$159  (via drill 1 pad 1.88)
  other vias: 18.41,31.43
N$160  (via drill 1 pad 1.88)
  other vias: 18.41,33.97
N$161  (via drill 1 pad 1.88)
  other vias: 20.95,36.51
N$162  (via drill 1 pad 1.88)
  other vias: 20.95,39.05
N$163  (via drill 1 pad 1.88)
  other vias: 20.95,41.59
N$164  (via drill 1 pad 1.88)
  other vias: 20.95,44.13
N$165  (via drill 1 pad 1.88)
  other vias: 18.41,44.13
N$166  (via drill 1 pad 1.88)
  other vias: 18.41,41.59
N$167  (via drill 1 pad 1.88)
  other vias: 18.41,39.05
N$168  (via drill 1 pad 1.88)
  other vias: 18.41,36.51
N$169  (via drill 1 pad 1.88)
  other vias: 15.88,33.97
N$170  (via drill 1 pad 1.88)
  other vias: 15.88,31.43
N$171  (via drill 1 pad 1.88)
  other vias: 15.88,28.89
N$172  (via drill 1 pad 1.88)
  other vias: 15.88,26.35
N$173  (via drill 1 pad 1.88)
  other vias: 18.41,23.81
N$174  (via drill 1 pad 1.88)
  other vias: 18.41,21.27
N$175  (via drill 1 pad 1.88)
  other vias: 18.41,18.73
N$176  (via drill 1 pad 1.88)
  other vias: 20.95,18.73
N$177  (via drill 1 pad 1.88)
  other vias: 20.95,16.19
N$178  (via drill 1 pad 1.88)
  other vias: 18.41,16.19
N$179  (via drill 1 pad 1.88)
  other vias: 20.95,13.65
N$180  (via drill 1 pad 1.88)
  other vias: 18.41,13.65
N$181  (via drill 1 pad 1.88)
  other vias: 18.41,11.11
N$182  (via drill 1 pad 1.88)
  other vias: 20.95,11.11
N$183  (via drill 1 pad 1.88)
  other vias: 20.95,8.57
N$184  (via drill 1 pad 1.88)
  other vias: 18.41,8.57
N$185  (via drill 1 pad 1.88)
  other vias: 18.41,6.03
N$186  (via drill 1 pad 1.88)
  other vias: 20.95,6.03
N$187  (via drill 1 pad 1.88)
  other vias: 20.95,3.49
N$188  (via drill 1 pad 1.88)
  other vias: 18.41,3.49
N$189  (via drill 1 pad 1.88)
  other vias: 15.88,21.27
N$190  (via drill 1 pad 1.88)
  other vias: 15.88,23.81
N$191  (via drill 1 pad 1.88)
  other vias: 13.34,26.35
N$192  (via drill 1 pad 1.88)
  other vias: 13.34,28.89
N$193  (via drill 1 pad 1.88)
  other vias: 13.34,31.43
N$194  (via drill 1 pad 1.88)
  other vias: 13.34,33.97
N$195  (via drill 1 pad 1.88)
  other vias: 15.88,36.51
N$196  (via drill 1 pad 1.88)
  other vias: 15.88,39.05
N$197  (via drill 1 pad 1.88)
  other vias: 15.88,41.59
N$198  (via drill 1 pad 1.88)
  other vias: 15.88,44.13
N$199  (via drill 1 pad 1.88)
  other vias: 13.34,44.13
N$200  (via drill 1 pad 1.88)
  other vias: 13.34,41.59
N$201  (via drill 1 pad 1.88)
  other vias: 13.34,39.05
N$202  (via drill 1 pad 1.88)
  other vias: 13.34,36.51
N$203  (via drill 1 pad 1.88)
  other vias: 10.79,33.97
N$204  (via drill 1 pad 1.88)
  other vias: 10.79,31.43
N$205  (via drill 1 pad 1.88)
  other vias: 10.79,28.89
N$206  (via drill 1 pad 1.88)
  other vias: 10.79,26.35
N$207  (via drill 1 pad 1.88)
  other vias: 13.34,23.81
N$208  (via drill 1 pad 1.88)
  other vias: 13.34,21.27
N$209  (via drill 1 pad 1.88)
  other vias: 13.34,18.73
N$210  (via drill 1 pad 1.88)
  other vias: 15.88,18.73
N$211  (via drill 1 pad 1.88)
  other vias: 15.88,16.19
N$212  (via drill 1 pad 1.88)
  other vias: 13.34,16.19
N$213  (via drill 1 pad 1.88)
  other vias: 15.88,13.65
N$214  (via drill 1 pad 1.88)
  other vias: 13.34,13.65
N$215  (via drill 1 pad 1.88)
  other vias: 13.34,11.11
N$216  (via drill 1 pad 1.88)
  other vias: 15.88,11.11
N$217  (via drill 1 pad 1.88)
  other vias: 15.88,8.57
N$218  (via drill 1 pad 1.88)
  other vias: 13.34,8.57
N$219  (via drill 1 pad 1.88)
  other vias: 13.34,6.03
N$220  (via drill 1 pad 1.88)
  other vias: 15.88,6.03
N$221  (via drill 1 pad 1.88)
  other vias: 15.88,3.49
N$222  (via drill 1 pad 1.88)
  other vias: 13.34,3.49
N$223  (via drill 1 pad 1.88)
  other vias: 10.79,21.27
N$224  (via drill 1 pad 1.88)
  other vias: 10.79,23.81
N$225  (via drill 1 pad 1.88)
  other vias: 8.26,26.35
N$226  (via drill 1 pad 1.88)
  other vias: 8.26,28.89
N$227  (via drill 1 pad 1.88)
  other vias: 8.26,31.43
N$228  (via drill 1 pad 1.88)
  other vias: 8.26,33.97
N$229  (via drill 1 pad 1.88)
  other vias: 10.79,36.51
N$230  (via drill 1 pad 1.88)
  other vias: 10.79,39.05
N$231  (via drill 1 pad 1.88)
  other vias: 10.79,41.59
N$232  (via drill 1 pad 1.88)
  other vias: 10.79,44.13
N$236  (via drill 1 pad 1.88)
  other vias: 8.26,36.51
N$237  (via drill 1 pad 1.88)
  other vias: 5.71,33.97
N$238  (via drill 1 pad 1.88)
  other vias: 5.71,31.43
N$239  (via drill 1 pad 1.88)
  other vias: 5.71,28.89
N$240  (via drill 1 pad 1.88)
  other vias: 5.71,26.35
N$241  (via drill 1 pad 1.88)
  other vias: 8.26,23.81
N$242  (via drill 1 pad 1.88)
  other vias: 8.26,21.27
N$243  (via drill 1 pad 1.88)
  other vias: 8.26,18.73
N$244  (via drill 1 pad 1.88)
  other vias: 10.79,18.73
N$245  (via drill 1 pad 1.88)
  other vias: 10.79,16.19
N$246  (via drill 1 pad 1.88)
  other vias: 8.26,16.19
N$247  (via drill 1 pad 1.88)
  other vias: 10.79,13.65
N$248  (via drill 1 pad 1.88)
  other vias: 8.26,13.65
N$249  (via drill 1 pad 1.88)
  other vias: 8.26,11.11
N$250  (via drill 1 pad 1.88)
  other vias: 10.79,11.11
N$251  (via drill 1 pad 1.88)
  other vias: 10.79,8.57
N$254  (via drill 1 pad 1.88)
  other vias: 10.79,6.03
N$255  (via drill 1 pad 1.88)
  other vias: 10.79,3.49
N$257  (via drill 1 pad 1.88)
  other vias: 5.71,21.27
N$258  (via drill 1 pad 1.88)
  other vias: 5.71,23.81
N$259  (via drill 1 pad 1.88)
  other vias: 3.18,26.35
N$260  (via drill 1 pad 1.88)
  other vias: 3.18,28.89
N$261  (via drill 1 pad 1.88)
  other vias: 3.18,31.43
N$262  (via drill 1 pad 1.88)
  other vias: 3.18,33.97
N$263  (via drill 1 pad 1.88)
  other vias: 5.71,36.51
N$270  (via drill 1 pad 1.88)
  other vias: 3.18,36.51
N$275  (via drill 1 pad 1.88)
  other vias: 3.18,23.81
N$276  (via drill 1 pad 1.88)
  other vias: 3.18,21.27
N$277  (via drill 1 pad 1.88)
  other vias: 3.18,18.73
N$278  (via drill 1 pad 1.88)
  other vias: 5.71,18.73
N$279  (via drill 1 pad 1.88)
  other vias: 5.71,16.19
N$280  (via drill 1 pad 1.88)
  other vias: 3.18,16.19
N$281  (via drill 1 pad 1.88)
  other vias: 5.71,13.65
N$282  (via drill 1 pad 1.88)
  other vias: 3.18,13.65
N$283  (via drill 1 pad 1.88)
  other vias: 3.18,11.11
N$284  (via drill 1 pad 1.88)
  other vias: 5.71,11.11
PRE5V
  Top 0.508: U2.3 80.08,31.41 F1.P$1 80.4,29.53 D3.C 82.76,30.8 88.11,30.8 88.97,31.66 SW4.P$1
RESET
  Top 0.305: IC1.11 65.01,20.89 SW3.P$3
  Top 0.508: SW3.P$1 SW3.P$3 63.02,19.62 63.02,13.02 65.56,10.48 JP4.3
USBVCC
  Top 0.508: JP1.5V 91.43,27.31 89.06,29.53 D3.A
VBATT
  Top 0.508: C1.1 77.54,34.84 78.9,36.2 | U2.1 78.99,36.28 78.9,36.2 | JP2.9 78.9,36.2
  Bottom 0.508: U$1.+$2 58.9,34.29 62.07,37.46 78.52,37.46 78.9,37.08 | JP2.9 78.9,37.08 | 78.9,37.08 79.03,36.96 U$1.+$1
XTAL1
  Top 0.305: IC1.14 68.08,19.07 68.42,18.73 70.01,18.73 70.33,18.41 70.33,16.51 69.84,16.03 | U$3.P$1 69.84,16.03 | C5.1 70.57,15.31 69.84,16.03
XTAL2
  Top 0.305: IC1.13 67.43,18.37 U$3.P$3 65.73,17.63 65.01,16.91 C6.1

### Text on the board
tPlace: '16
tNames: & | ScHnRk v0.2
bNames: NUSHackers